# EAGLE board stm32_02 (EAGLE 9.5.2)
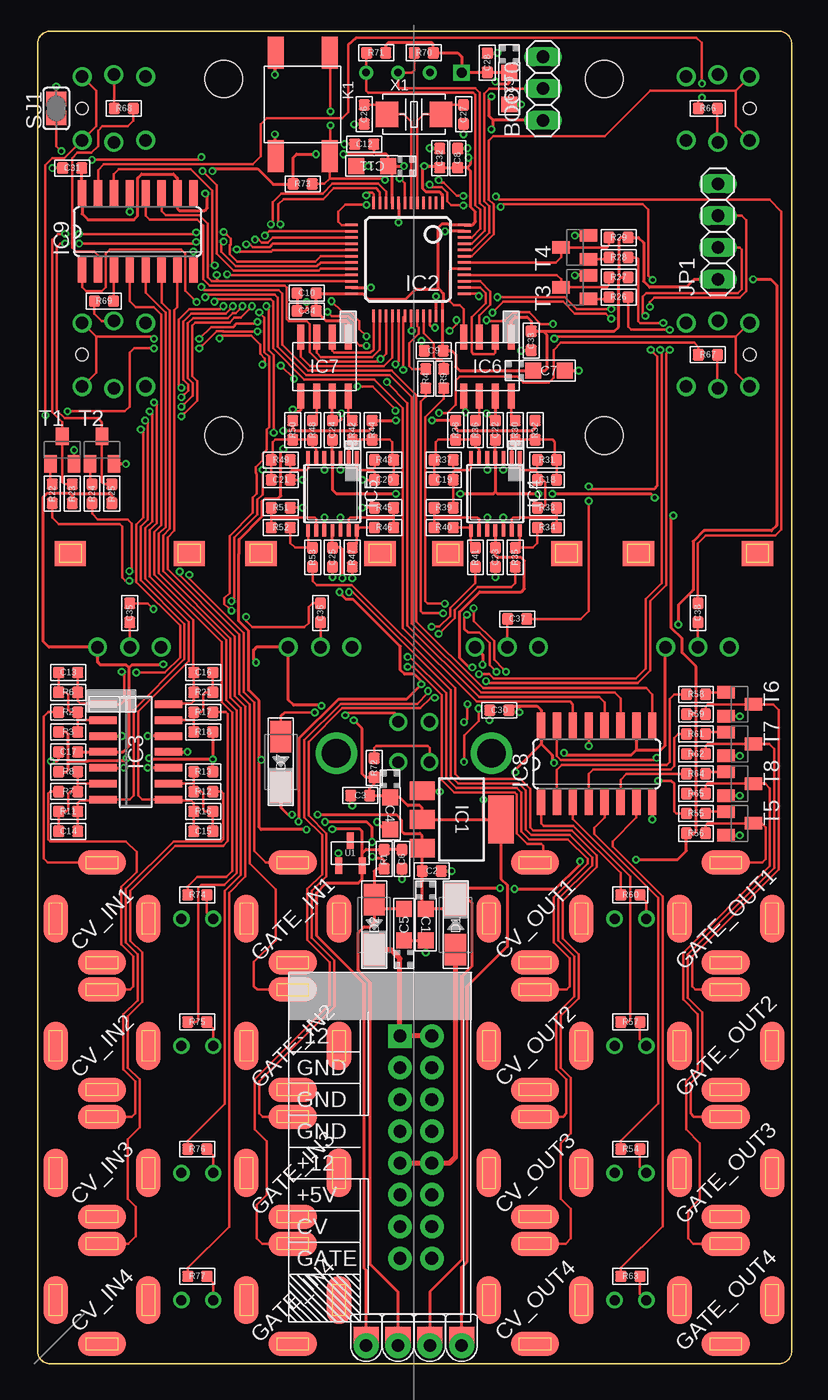
[diagram p4: board, top side]
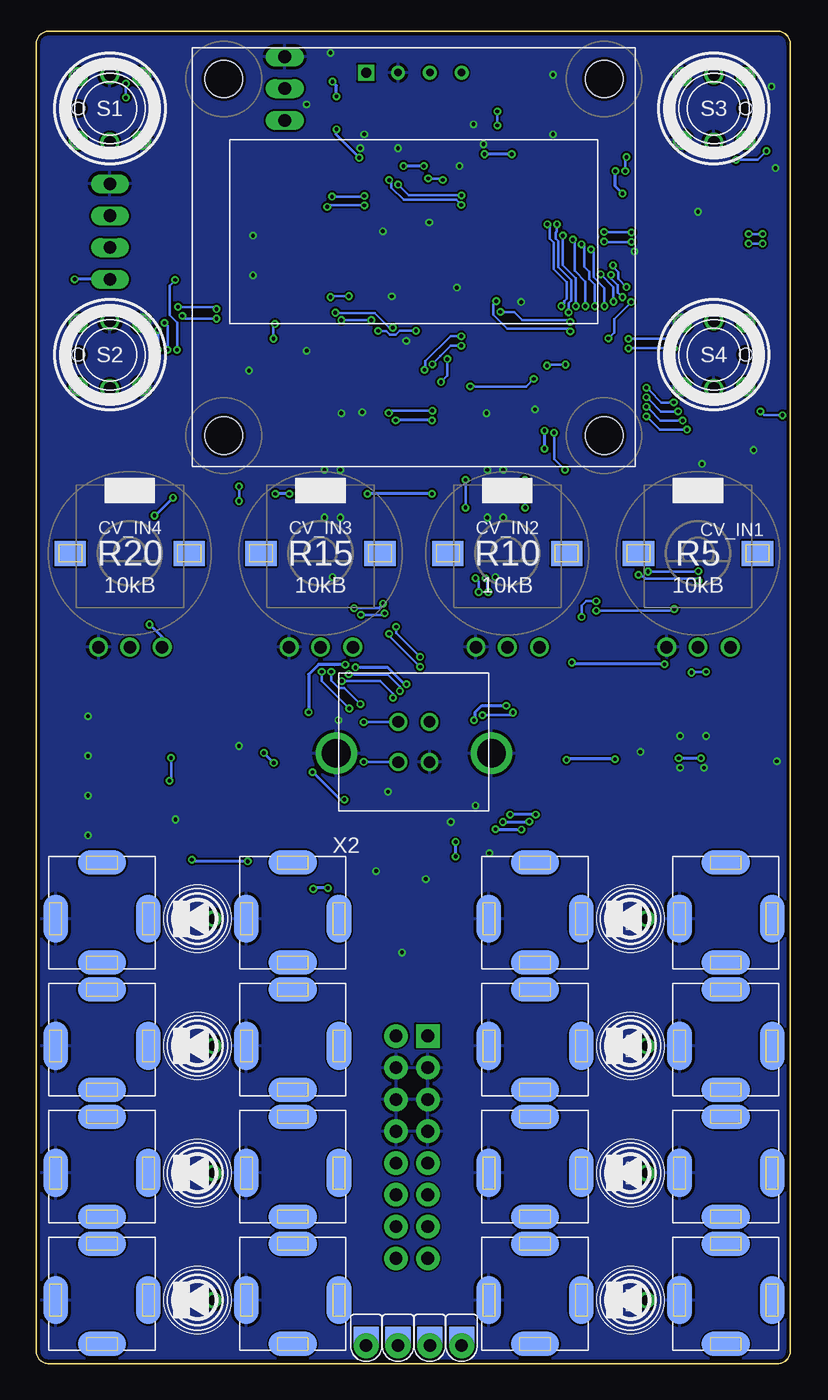
[diagram p5: board, bottom side, seen from below]

Size 60.25 x 106.5 mm. Coordinates in mm from the lower left corner, seen from the top.
Copper layers (1*16): Top 0.035mm / dielectric 1.5mm / Bottom 0.035mm
Design rules "ITeadstudio": minimum track width 6mil, minimum drill 12mil, track to track 6mil, track to pad 6mil, pad to pad 6mil, via to via 6mil, smd to smd 0mil, copper to edge 10mil, drill to drill 10mil, minimum pad ring 10mil, minimum via ring 6mil, stop-mask expansion 2mil, vias tented up to drill 100mil, thermal gap 10mil
Net classes: 0 default: width 0.203 mm; 1 POWER: width 0.254 mm

## Footprints (pad centres in the part's own frame; a part is rotated, then mirrored left to right if it is on the bottom)
1X03 = drill 1.016 long: 1 -2.54,0; 2 0,0; 3 2.54,0
CASE-A_3216 = smd 1.27 x 1.27: + -1.27,0; - 1.27,0
C0603 = smd 0.889 x 0.889: 1 -0.762,0; 2 0.762,0
DO-214AC = smd 2.5 x 1.7: 1 -2,0; 2 2,0
3MMLED = drill 0.8: + -1.27,0; - 1.27,0
SOT223 = smd 1.5 x 2: 1 -2.3,-3.15; 2 0,-3.15; 3 2.3,-3.15 | smd 3.8 x 2: 4 0,3.15
TQFP48 = smd 0.2 x 1: 1 -2.75,-4.5; 2 -2.25,-4.5; 3 -1.75,-4.5; 4 -1.25,-4.5; 5 -0.75,-4.5; 6 -0.25,-4.5; 7 0.25,-4.5; 8 0.75,-4.5; 9 1.25,-4.5; 10 1.75,-4.5; 11 2.25,-4.5; 12 2.75,-4.5; 25 2.75,4.5; 26 2.25,4.5; 27 1.75,4.5; 28 1.25,4.5; 29 0.75,4.5; 30 0.25,4.5; 31 -0.25,4.5; 32 -0.75,4.5; 33 -1.25,4.5; 34 -1.75,4.5; 35 -2.25,4.5; 36 -2.75,4.5 | smd 1 x 0.2: 13 4.5,-2.75; 14 4.5,-2.25; 15 4.5,-1.75; 16 4.5,-1.25; 17 4.5,-0.75; 18 4.5,-0.25; 19 4.5,0.25; 20 4.5,0.75; 21 4.5,1.25; 22 4.5,1.75; 23 4.5,2.25; 24 4.5,2.75; 37 -4.5,2.75; 38 -4.5,2.25; 39 -4.5,1.75; 40 -4.5,1.25; 41 -4.5,0.75; 42 -4.5,0.25; 43 -4.5,-0.25; 44 -4.5,-0.75; 45 -4.5,-1.25; 46 -4.5,-1.75; 47 -4.5,-2.25; 48 -4.5,-2.75
SO14 = smd 0.6 x 2.2: 1 -3.81,-2.6; 2 -2.54,-2.6; 3 -1.27,-2.6; 4 0,-2.6; 5 1.27,-2.6; 6 2.54,-2.6; 7 3.81,-2.6; 8 3.81,2.6; 9 2.54,2.6; 10 1.27,2.6; 11 0,2.6; 12 -1.27,2.6; 13 -2.54,2.6; 14 -3.81,2.6
TSSOP14 = smd 0.305 x 0.991: 1 -1.95,-2.918; 2 -1.3,-2.918; 3 -0.65,-2.918; 4 0,-2.918; 5 0.65,-2.918; 6 1.3,-2.918; 7 1.95,-2.918; 8 1.95,2.918; 9 1.3,2.918; 10 0.65,2.918; 11 0,2.918; 12 -0.65,2.918; 13 -1.3,2.918; 14 -1.95,2.918
SOIC8-N_MC = smd 1.981 x 0.559: 1 -2.362,1.905; 2 -2.362,0.635; 3 -2.362,-0.635; 4 -2.362,-1.905; 5 2.362,-1.905; 6 2.362,-0.635; 7 2.362,0.635; 8 2.362,1.905
SO16 = smd 0.66 x 2.032: 1 -4.445,-3.073; 2 -3.175,-3.073; 3 -1.905,-3.073; 4 -0.635,-3.073; 5 0.635,-3.073; 6 1.905,-3.073; 7 3.175,-3.073; 8 4.445,-3.073; 9 4.445,3.073; 10 3.175,3.073; 11 1.905,3.073; 12 0.635,3.073; 13 -0.635,3.073; 14 -1.905,3.073; 15 -3.175,3.073; 16 -4.445,3.073
POWER_16_SHROUDED = drill 1.016 pad 1.88 square: 1 -8.89,-1.27 | drill 1.016 pad 1.88: 2 -8.89,1.27; 3 -6.35,-1.27; 4 -6.35,1.27; 5 -3.81,-1.27; 6 -3.81,1.27; 7 -1.27,-1.27; 8 -1.27,1.27; 9 1.27,-1.27; 10 1.27,1.27; 11 3.81,-1.27; 12 3.81,1.27; 13 6.35,-1.27; 14 6.35,1.27; 15 8.89,-1.27; 16 8.89,1.27
3.5MM-JACK-SWITCH-13MM-NOHOLES = smd 1.95 x 3.85 bottom: RING_B@1 -3.7,0; SWITCH_B@1 3.7,0 | smd 1.95 x 3.85: RING_T@3 -3.7,0; SWITCH_T@3 3.7,0 | smd 3.85 x 1.95 bottom: SECOND_B@1 0,-3.5; TIP_B@1 0,4.5 | smd 3.85 x 1.95: SECOND_T@3 0,-3.5; TIP_T@3 0,4.5
1X04 = drill 1.016 long: 1 -3.81,0; 2 -1.27,0; 3 1.27,0; 4 3.81,0
4P-SMD-6.0X6.0X5.0H = smd 2.54 x 1.27: 1 -4.129,2.159; 2 -4.129,-2.159; 3 4.129,-2.159; 4 4.129,2.159
R0603 = smd 0.889 x 0.889: 1 -0.762,0; 2 0.762,0
ALPS_POT_SQUAREHOLES = drill 1: P$1 -2.5,-7.5; P$2 0,-7.5; P$3 2.58,-7.5 | smd 2.5 x 2: P$4 -4.75,0; P$5 4.75,0 | smd 2.5 x 2 bottom: P$6 -4.75,0; P$7 4.75,0
PB6149L = drill 1: 1 2.54,2.54; 2 2.54,-2.54; 3 -2.54,2.54; 4 -2.54,-2.54; LEDNEG 0,-2.7; LEDPOS 0,2.7 | hole 1: 2.54,0
SJ = smd 1.168 x 1.6: 1 -0.762,0; 2 0.762,0
SOT23-BEC = smd 1 x 1.4: B -0.95,-1.1; C 0,1.1; E 0.95,-1.1
SOT95P237X112-3N = smd 1.321 x 0.559: 1 -1.016,0.94; 2 -1.016,-0.94; 3 1.016,0
POWERTESTPAD = drill 1 pad 2: P$1 0,0 | smd 2 x 1.5: P$2 0,-0.75 | smd 2 x 1.5 bottom: P$3 0,-0.75
1.3_4PIN_OLED = drill 0.8 square: P$1 -3.81,0 | drill 0.6: P$2 -1.27,0; P$3 1.27,0; P$4 3.81,0 | hole 3: -15.2,-0.5; 15.2,-0.5; -15.2,-29; 15.2,-29
2P-SMD-5.0X3.2 = smd 1.778 x 2.032: 1 -2.159,0; 2 2.159,0
USB_B_VERT = drill 0.92: 1 1.25,1.6; 2 -1.25,1.6; 3 -1.25,-1.6; 4 1.25,-1.6 | drill 2.3: G1 -6.2,-0.9; G2 6.2,-0.9

## Placement (x,y rotation side)
BOOT0  [1X03]  40.39,101.92 90 top
C1  10uF  [CASE-A_3216]  31.02,35.08 270 top
C2  100nF  [C0603]  31.5,39.37 180 top
C3  100nF  [C0603]  25.79,45.4 0 top
C4  10uF  [CASE-A_3216]  28.17,43.97 270 top
C5  10uF  [CASE-A_3216]  29.28,35.08 90 top
C6  100nF  [C0603]  29.12,40.32 90 top
C7  10uF  [CASE-A_3216]  40.87,79.38 0 top
C8  100nF  [C0603]  33.56,96.36 270 top
C9  100nF  [C0603]  31.66,80.96 0 top
C10  100nF  [C0603]  21.5,85.57 0 top
C11  10uF  [CASE-A_3216]  26.74,95.73 180 top
C12  100nF  [C0603]  26.1,97.47 0 top
C13  3.3nF  [C0603]  2.45,55.24 0 top
C14  3.3nF  [C0603]  2.45,42.55 0 top
C15  3.3nF  [C0603]  13.24,42.55 180 top
C16  3.3nF  [C0603]  13.24,55.24 180 top
C17  [C0603]  2.45,48.9 0 top
C18  3.3nF  [C0603]  40.71,70.64 180 top
C19  3.3nF  [C0603]  32.45,70.64 0 top
C20  3.3nF  [C0603]  27.69,70.64 180 top
C21  3.3nF  [C0603]  19.43,70.64 0 top
C22  100nF  [C0603]  36.58,74.61 90 top
C23  100nF  [C0603]  36.58,64.45 90 top
C24  100nF  [C0603]  23.56,74.61 90 top
C25  100nF  [C0603]  23.56,64.45 90 top
C26  20pF  [C0603]  26.1,99.85 270 top
C27  20pF  [C0603]  34.04,99.85 270 top
C28  100nF  [C0603]  35.95,103.98 270 top
C29  10uF  [CASE-A_3216]  37.69,101.92 270 top
C30  100nF  [C0603]  36.9,52.23 0 top
C31  100nF  [C0603]  2.77,95.57 0 top
C32  100nF  [C0603]  32.13,96.36 270 top
C33  100nF  [C0603]  39.44,81.76 270 top
C34  100nF  [C0603]  21.5,84.14 180 top
C35  100nF  [C0603]  7.37,60.01 90 top
C36  100nF  [C0603]  22.61,60.01 90 top
C37  100nF  [C0603]  38.33,59.53 0 top
C38  100nF  [C0603]  52.77,60.01 90 top
D1  [DO-214AC]  33.41,35.08 90 top
D2  [DO-214AC]  26.9,35.08 270 top
D3  [3MMLED]  47.38,15.24 180 bottom
D4  [3MMLED]  47.38,25.4 180 bottom
D5  [3MMLED]  47.38,35.56 180 bottom
D6  [3MMLED]  47.38,5.08 180 bottom
D7  [DO-214AC]  19.43,48.1 270 top
D11  [3MMLED]  12.77,35.56 180 bottom
D12  [3MMLED]  12.77,25.4 180 bottom
D13  [3MMLED]  12.77,15.24 180 bottom
D14  [3MMLED]  12.77,5.08 180 bottom
IC1  LD1117AS33TR  [SOT223]  33.88,43.5 270 top
IC2  STM32F10XCXT6  [TQFP48]  29.59,88.27 180 top
IC3  MCP6004  [SO14]  7.85,48.9 270 top
IC4  TL074TSSOP14  [TSSOP14]  36.58,69.53 180 top
IC5  TL074TSSOP14  [TSSOP14]  23.56,69.53 180 top
IC6  MCP4822-E/SN  [SOIC8-N_MC]  35.95,79.69 270 top
IC7  MCP4822-E/SN  [SOIC8-N_MC]  22.93,79.69 270 top
IC8  74HC595D  [SO16]  44.68,47.94 0 top
IC9  74HC595D  [SO16]  8.01,90.49 0 top
J1  POWERSHROUDED  [POWER_16_SHROUDED]  30.23,17.3 270 top
J2  JACK  [3.5MM-JACK-SWITCH-13MM-NOHOLES]  5.15,35.56 0 bottom
J3  JACK  [3.5MM-JACK-SWITCH-13MM-NOHOLES]  5.15,25.4 0 bottom
J4  JACK  [3.5MM-JACK-SWITCH-13MM-NOHOLES]  5.15,15.24 0 bottom
J5  JACK  [3.5MM-JACK-SWITCH-13MM-NOHOLES]  5.15,5.08 0 bottom
J6  JACK  [3.5MM-JACK-SWITCH-13MM-NOHOLES]  20.39,35.56 0 bottom
J7  JACK  [3.5MM-JACK-SWITCH-13MM-NOHOLES]  20.39,25.4 0 bottom
J8  JACK  [3.5MM-JACK-SWITCH-13MM-NOHOLES]  20.39,15.24 0 bottom
J9  JACK  [3.5MM-JACK-SWITCH-13MM-NOHOLES]  20.39,5.08 0 bottom
J10  JACK  [3.5MM-JACK-SWITCH-13MM-NOHOLES]  39.76,35.56 0 bottom
J11  JACK  [3.5MM-JACK-SWITCH-13MM-NOHOLES]  39.76,25.4 0 bottom
J12  JACK  [3.5MM-JACK-SWITCH-13MM-NOHOLES]  39.76,15.24 0 bottom
J13  JACK  [3.5MM-JACK-SWITCH-13MM-NOHOLES]  39.76,5.08 0 bottom
J14  JACK  [3.5MM-JACK-SWITCH-13MM-NOHOLES]  54.99,35.56 0 bottom
J15  JACK  [3.5MM-JACK-SWITCH-13MM-NOHOLES]  54.99,25.4 0 bottom
J16  JACK  [3.5MM-JACK-SWITCH-13MM-NOHOLES]  54.99,15.24 0 bottom
J17  JACK  [3.5MM-JACK-SWITCH-13MM-NOHOLES]  54.99,5.08 0 bottom
JP1  [1X04]  54.36,90.49 90 top
K1  BUTTON-4P-3100010P1  [4P-SMD-6.0X6.0X5.0H]  21.18,100.65 270 top
PCB1  EURORACK_PCB12HP  [EURORACK12HPPCB]  -0.25,0 0 top
R1  10k  [R0603]  27.69,40.32 90 top
R2  100k  [R0603]  2.45,52.07 0 top
R3  100k  [R0603]  2.45,50.48 0 top
R4  20r  [R0603]  31.02,78.74 90 top
R5  10kB  [ALPS_POT_SQUAREHOLES]  7.37,64.77 0 bottom
R6  33k  [R0603]  2.45,53.66 0 top
R7  100k  [R0603]  2.45,45.72 0 top
R8  51k  [R0603]  2.45,47.31 0 top
R9  20r  [R0603]  32.45,78.74 90 top
R10  10kB  [ALPS_POT_SQUAREHOLES]  22.61,64.77 0 bottom
R11  33k  [R0603]  2.45,44.13 0 top
R12  100k  [R0603]  13.24,45.72 180 top
R13  51k  [R0603]  13.24,47.31 180 top
R15  10kB  [ALPS_POT_SQUAREHOLES]  37.53,64.77 0 bottom
R16  33k  [R0603]  13.24,44.13 180 top
R17  100k  [R0603]  13.24,52.07 180 top
R18  51k  [R0603]  13.24,50.48 180 top
R20  10kB  [ALPS_POT_SQUAREHOLES]  52.77,64.77 0 bottom
R21  33k  [R0603]  13.24,53.66 180 top
R22  100k  [R0603]  1.18,69.53 90 top
R23  10k  [R0603]  2.77,69.53 270 top
R24  100k  [R0603]  4.35,69.53 90 top
R25  10k  [R0603]  5.94,69.53 270 top
R26  100k  [R0603]  46.42,85.25 180 top
R27  10k  [R0603]  46.42,86.84 0 top
R28  100k  [R0603]  46.42,88.42 180 top
R29  10k  [R0603]  46.42,90.01 0 top
R30  12k  [R0603]  38.17,74.61 270 top
R31  30k  [R0603]  40.71,72.23 180 top
R32  1m  [R0603]  39.76,74.61 270 top
R33  100k  [R0603]  40.71,68.42 0 top
R34  100k  [R0603]  40.71,66.83 180 top
R35  100r  [R0603]  38.17,64.45 270 top
R36  12k  [R0603]  34.99,74.61 270 top
R37  30k  [R0603]  32.45,72.23 0 top
R38  1m  [R0603]  33.41,74.61 270 top
R39  100k  [R0603]  32.45,68.42 180 top
R40  100k  [R0603]  32.45,66.83 0 top
R41  100r  [R0603]  34.99,64.45 270 top
R42  12k  [R0603]  25.15,74.61 270 top
R43  30k  [R0603]  27.69,72.23 180 top
R44  1m  [R0603]  26.74,74.61 270 top
R45  100k  [R0603]  27.69,68.42 0 top
R46  100k  [R0603]  27.69,66.83 180 top
R47  100r  [R0603]  25.15,64.45 270 top
R48  12k  [R0603]  21.98,74.61 270 top
R49  30k  [R0603]  19.43,72.23 0 top
R50  1m  [R0603]  20.39,74.61 270 top
R51  100k  [R0603]  19.43,68.42 180 top
R52  100k  [R0603]  19.43,66.83 0 top
R53  100r  [R0603]  21.98,64.45 270 top
R54  56r  [R0603]  47.38,17.14 180 top
R55  100k  [R0603]  52.61,43.97 180 top
R56  10k  [R0603]  52.61,42.39 180 top
R57  56r  [R0603]  47.38,27.3 180 top
R58  100k  [R0603]  52.61,53.5 180 top
R59  10k  [R0603]  52.61,51.91 180 top
R60  56r  [R0603]  47.38,37.47 180 top
R61  100k  [R0603]  52.61,50.32 180 top
R62  10k  [R0603]  52.61,48.74 180 top
R63  56r  [R0603]  47.38,6.99 180 top
R64  100k  [R0603]  52.61,47.15 180 top
R65  10k  [R0603]  52.61,45.56 180 top
R66  56r  [R0603]  53.57,100.33 180 top
R67  56r  [R0603]  53.57,80.64 180 top
R68  56r  [R0603]  6.89,100.33 0 top
R69  56r  [R0603]  5.31,84.93 0 top
R70  2k  [R0603]  30.86,104.78 180 top
R71  2k  [R0603]  27.05,104.78 180 top
R72  1.5k  [R0603]  26.9,47.62 270 top
R73  10k  [R0603]  21.18,94.3 180 top
R74  56r  [R0603]  12.77,37.47 180 top
R75  56r  [R0603]  12.77,27.3 180 top
R76  56r  [R0603]  12.77,17.14 180 top
R77  56r  [R0603]  12.77,6.99 180 top
S1  SWITCH_W_LED_PB6149L-X-102BLUE  [PB6149L]  54.36,100.33 180 bottom
S2  SWITCH_W_LED_PB6149L-X-102BLUE  [PB6149L]  54.36,80.64 180 bottom
S3  SWITCH_W_LED_PB6149L-X-102BLUE  [PB6149L]  6.1,100.33 0 bottom
S4  SWITCH_W_LED_PB6149L-X-102BLUE  [PB6149L]  6.1,80.64 0 bottom
SJ1  [SJ]  1.5,100.33 90 top
T1  [SOT23-BEC]  1.97,73.03 0 top
T2  [SOT23-BEC]  5.15,73.03 0 top
T3  [SOT23-BEC]  42.93,86.04 90 top
T4  [SOT23-BEC]  42.93,89.22 90 top
T5  [SOT23-BEC]  56.11,43.18 270 top
T6  [SOT23-BEC]  56.11,52.7 270 top
T7  [SOT23-BEC]  56.11,49.53 270 top
T8  [SOT23-BEC]  56.11,46.35 270 top
U1  LM4040DIM3-5.0  [SOT95P237X112-3N]  24.99,40.8 90 top
U$7  VOLTAGETESTPAD  [POWERTESTPAD]  31.34,1.43 180 top
U$8  VOLTAGETESTPAD  [POWERTESTPAD]  28.8,1.43 180 top
U$37  VOLTAGETESTPAD  [POWERTESTPAD]  33.88,1.43 180 top
U$38  VOLTAGETESTPAD  [POWERTESTPAD]  26.26,1.43 180 top
U$44  4PIN_OLED  [1.3_4PIN_OLED]  30.07,103.19 0 bottom
X1  CRYSTAL-0500290P1  [2P-SMD-5.0X3.2]  30.07,99.85 0 top
X2  USB_B_FEMALE_VERT  [USB_B_VERT]  30.07,49.69 0 bottom

## Tracks (layer width: path | path; a pad name or v marks a point on that pad's centre or on a via)
3.3V  (via drill 0.3)
  Top 0.254: 32.34,95.39 C32.2 | C32.2 32.01,95.73 v30.9,95.73 30.75,95.57 30.75,93.94 31.02,93.66 32.13,93.66 32.34,93.45 IC2.1 | R71.1 27.82,105.38 28.01,105.57 31.5,105.57 31.63,105.44 R70.1 33.56,104.78 33.88,104.46 U$44.P$1 35.91,103.19 C28.2 35.98,103.19 C29.+ 37.69,102.39 37.6,102.3 36.76,102.3 v36.58,102.48 | C32.2 C8.2 34.33,95.6 | C17.2 IC3.4 6.83,48.9 7.31,49.37 7.31,55.63 | 7.31,55.63 7.05,55.88 4.99,55.88 4.79,56.08 R5.P$3 0.9,57.27 0.45,57.72 0.45,69.27 0.72,69.53 2.61,69.53 2.77,69.37 | U$37.P$1 33.88,7.7 34.29,8.12 34.29,30.1 37.53,33.34 37.53,38.26 37.03,38.76 IC1.4 35.79,43.5 | 35.79,43.5 IC1.2 30.73,44.42 30.55,44.61 29.59,44.61 28.96,45.24 C4.+ 28.01,45.4 C3.2 26.55,46.01 26.9,46.35 R72.2 26.23,46.86 25.94,47.15 25.94,50.75 v25.27,51.43 | v22.25,96.68 20.7,96.68 20.42,96.39 R73.2 20.39,94.27 18.83,94.27 17.59,95.5 14.15,95.5 v13.97,95.33 | IC7.1 24.83,83.19 24.67,83.34 23.05,83.34 C34.1 C10.2 22.31,85.52 IC2.24 26,85.52 26.42,85.09 29.44,85.09 30.24,85.89 32.09,85.89 | BOOT0.1 36.42,99.38 | 36.42,99.38 36.1,99.69 36.1,101.13 v36.26,101.29 | C31.2 3.53,93.59 IC9.16 3.56,91.92 4.04,91.44 7.69,91.44 8.01,91.76 8.01,94.77 8.32,95.09 10.86,95.09 11.18,94.77 IC9.10 11.18,92.33 11.34,92.18 13.35,92.18 13.56,92.39 13.56,93.36 v13.4,93.53 | 46.58,86.84 46.42,87 46.42,89.85 46.58,90.01 R29.2 48.01,90.01 48.43,89.59 48.43,86.52 48.91,86.04 51.82,86.04 52.45,86.68 JP1.1 | 46.58,86.84 R27.2 | 34.33,95.6 34.61,95.31 34.61,92.46 34.99,92.08 34.99,91.28 34.73,91.02 IC2.48 32.88,91.02 32.8,91.1 32.31,91.1 31.97,90.76 31.97,86.01 32.09,85.89
  Top 0.254: C30.2 37.98,52.55 38.48,52.55 | 38.48,52.55 39.91,52.55 40.23,52.23 IC8.16 40.23,49.53 | R23.2 2.77,69.37 | 2.77,69.37 2.92,69.53 5.78,69.53 5.94,69.37 R25.2 | v38.17,47.28 38.17,47.47 40.23,49.53 | v35.63,45.09 35.63,43.66 35.79,43.5 | 40.23,49.53 41.12,48.64 41.12,48.17 v41.27,48.02 | v42.06,48.82 42.24,48.64 47.44,48.64 47.85,49.05 | IC8.10 47.85,49.05 | IC6.1 37.85,83.34 38.17,83.66 39.12,83.66 39.44,83.34 C33.1 40.39,82.52 | 40.39,82.52 46.07,82.52 46.42,82.87 46.42,86.68 46.58,86.84 | v24.43,96.68 26.74,96.68 26.9,96.84 | 26.9,96.84 26.9,97.44 C12.2 | 26.9,96.84 27.05,96.68 27.85,96.68 28.01,96.52 C11.+ 28.17,95.73 | v22.69,52.59 22.44,52.59 22.39,52.64 20.46,52.64 20.03,53.06 R10.P$3 19.99,57.31 17.53,57.31 17.27,57.05 17.27,56.3 17.45,56.12 v17.45,56.04 | 7.31,55.63 7.56,55.88 10.02,55.88 v10.04,55.91 | 40.39,82.52 40.71,82.2 40.71,79.53 40.55,79.38 C7.+ 33.72,79.38 33.41,79.69 33.41,80.64 33.09,80.96 C9.2 32.34,81.04 IC2.36 32.34,84.98 32.43,85.06 32.43,85.55 32.09,85.89 | R15.P$3 35.56,56.66 v35.56,55.87 | v38.48,52.07 38.48,52.55 | 47.85,49.05 49.81,49.05 50.13,49.37 50.13,57.21 R20.P$3 | 34.33,95.6 34.61,95.89 34.61,96.22 v34.43,96.39 | v36.26,98.67 36.42,98.83 36.42,99.38 | v57.18,86.68 58.58,86.68 59.06,86.2 59.06,66.99 58.65,66.58 53.25,66.58 52.39,65.72 52.39,61.85 51.2,60.66 v51.2,59.08 | 28.17,95.73 v29.28,95.73 | IC2.9 28.34,95.55 28.17,95.73
  Bottom 0.254: v29.28,95.73 v30.9,95.73 | v22.25,96.68 v24.43,96.68 | v36.26,101.29 36.26,102.16 v36.58,102.48 | v38.17,47.28 35.98,45.09 v35.63,45.09 | v41.27,48.02 v42.06,48.81 v42.06,48.82 | v25.27,51.43 25.17,51.52 25.17,52.07 24.65,52.59 v22.69,52.59 | v10.04,55.91 17.31,55.91 v17.45,56.04 | v35.56,55.87 36.41,55.87 36.43,55.89 37.68,55.89 38.48,55.08 v38.48,52.07 | v13.4,93.53 13.97,94.1 v13.97,95.33 | v34.43,96.39 36.26,98.22 v36.26,98.67 | JP1.1 v57.18,86.68 | v51.2,59.08 50.19,58.07 R20.P$3
5V  (via drill 0.3)
  Top 0.203: D7.1 19.43,51.75 19.73,52.05 v22.15,52.05 | X2.1 28.82,51.72 28.56,51.99 24.75,51.99 v24.59,51.83
  Bottom 0.203: v22.15,52.05 22.38,51.83 v24.59,51.83
12V  (via drill 0.3)
  Top 0.254: C22.1 IC4.4 36.58,69.69 | C24.1 IC5.4 23.56,69.85 23.88,69.53 v28.63,69.53 | D1.2 32.67,36.35 C1.+ 30.74,36.64 C2.2 IC1.3 30.73,42.2 30.55,42.39 29.28,42.39 29.08,42.58 29.08,43.45 28.65,43.89 v22.38,43.89 | D1.2 34.42,37.08 34.67,36.83 34.67,31.75 33.89,30.96 33.89,8.28 31.34,5.74 U$7.P$1 | 52.45,51.91 52.61,51.75 52.61,48.74 | 52.45,51.91 R59.2 | 52.61,45.56 52.61,42.55 52.45,42.39 R56.2 51.85,40.99 51.15,40.28 v47.81,40.28 | 52.61,45.56 52.61,48.74 | R62.2 52.61,48.74 | R65.2 52.61,45.56 | D1.2 34.34,38.02 v36.95,38.02 | v38.12,37.94 41.38,37.94 43.34,39.9 v43.34,40.15 | 52.45,51.91 52.61,52.07 52.61,55.72 51.5,56.83 51.5,57.94 50.61,58.83 50.61,67.61 v50.79,67.79 | 36.58,69.69 36.74,69.53 v40.02,69.53 | v49.32,69.22 49,69.53 v41.14,69.53 | D7.2 19.43,44.45 20,43.89 v20.34,43.89 | v33.77,69.53 36.42,69.53 36.58,69.69
  Bottom 0.254: v36.95,38.02 38.04,38.02 v38.12,37.94 | v43.34,40.15 47.68,40.15 v47.81,40.28 | v40.02,69.53 v41.14,69.53 | v49.32,69.22 50.75,67.79 v50.79,67.79 | v20.34,43.89 20.59,43.89 20.61,43.91 22.35,43.91 v22.38,43.89 | v28.63,69.53 v33.77,69.53
-5V  (via drill 0.3)
  Top 0.254: R8.1 2.29,47.31 2.45,47.47 2.45,48.1 | 2.45,48.1 2.45,50.32 2.29,50.48 R3.1 | R13.1 v14.01,48.32 | v14.01,48.32 9.07,48.32 9,48.39 v8.91,48.39 | 2.45,48.1 2.52,48.17 4,48.17 4.04,48.21 6.95,48.21 v7.13,48.39 | C6.2 R1.2 27.66,41.12 26.26,41.12 25.93,40.79 | 25.93,40.79 U1.2 25.94,39.77 25.94,38.73 25.63,38.42 23.09,38.42 22.29,37.62 22.29,34.19 26.1,30.38 26.1,7.62 26.26,7.46 U$38.P$3 | R50.1 20.39,74.73 | 20.39,74.73 20.55,74.57 26.54,74.57 26.74,74.77 R44.1 28.6,75.37 v28.63,75.41 | R32.1 39.76,74.77 39.56,74.57 33.56,74.57 33.41,74.73 R38.1 33.37,75.41 v31.52,75.41 | R18.1 v14.01,48.32 | 25.93,40.79 25.93,42.56 25.73,42.76 23.58,42.76 v23.55,42.72 | v21.49,42.69 17.87,42.69 17.7,42.86 17.7,48.08 v17.88,48.26 17.7,48.44 17.7,52.99 16.86,53.83 16.86,58.57 16.08,59.35 16.08,64.75 16.1,64.77 16.1,65.88 17.95,67.73 17.95,68.92 18.18,69.14 19.21,69.14 19.43,69.37 19.43,72.93 v19.64,73.13 | v19.64,74.57 19.89,74.57 20.23,74.57 20.39,74.73
  Bottom 0.254: v7.13,48.39 v8.91,48.39 | v14.01,48.32 17.82,48.32 v17.88,48.26 | v23.55,42.72 21.51,42.72 v21.49,42.69 | v28.63,75.41 v31.52,75.41 | v19.64,73.13 v19.64,74.57
-12V  (via drill 0.3)
  Top 0.254: IC4.11 C23.2 36.58,64.61 36.78,64.41 38.66,64.41 38.89,64.19 38.89,61.94 38.64,61.69 35.32,61.69 33.72,60.09 33.72,56.41 34.48,55.65 v34.74,55.65 | IC5.11 C25.2 23.59,65.25 24.2,65.25 24.36,65.09 v24.36,62.79 | C5.- 27.63,36.35 26.94,37.04 | 26.94,37.04 D2.1 26.9,39.37 27.09,39.56 R1.1 27.69,40.2 27.53,40.36 26.91,40.36 v26.74,40.53 | U$8.P$3 28.8,5.71 26.58,7.94 26.58,30.48 25.63,31.43 25.63,34.45 26.1,34.92 26.58,34.92 26.94,35.29 26.94,37.04 | v26.74,41.7 26.74,42.86 26.3,43.3 v22.96,43.3 | v20.85,43.33 20.92,43.4 20.92,49.99 24.05,53.12 29.48,53.12 v30.66,54.3 30.66,54.55 30.09,55.11 29.33,55.11 28.99,55.46 28.99,57.33 25.23,61.09 24.65,61.09 24.31,61.43 24.31,61.49 v24.13,61.67
  Bottom 0.254: v26.74,40.53 v26.74,41.7 | v22.96,43.3 20.88,43.3 v20.85,43.33 | v24.13,61.67 24.2,61.74 24.2,62.63 v24.36,62.79 | v30.66,54.3 30.82,54.3 32.17,55.65 v34.74,55.65
BTN_IN1
  Top 0.203: S1.1 55.79,98.9 55.79,101.76 | 55.79,101.76 S1.2 | 55.79,101.76 48.96,101.76 45.31,98.11 36.42,98.11 36.06,97.75 36.06,93.06 36.44,92.67 36.44,90.27 34.69,88.52 IC2.43
BTN_IN2  (via drill 0.3)
  Top 0.203: S2.1 55.79,79.22 55.79,82.07 | 55.79,82.07 S2.2 | IC2.31 29.84,82.62 v29.9,82.56 | v41.29,81.93 41.43,82.07 55.79,82.07 | v41.18,83.1 40.22,83.1 39.28,84.04 38.01,84.04 37.31,83.34 35.94,83.34 v35.87,83.41 | v33.48,83.41 33.48,83.1 v32.93,82.55
  Bottom 0.203: v29.9,82.56 31.22,82.56 31.53,82.25 31.99,82.25 32.29,82.55 v32.93,82.55 | v41.29,81.93 41.29,83 v41.18,83.1 | v35.87,83.41 v33.48,83.41
BTN_IN3  (via drill 0.3)
  Top 0.203: S3.1 4.67,101.76 4.67,98.9 S3.2 2.13,96.36 1.18,96.36 0.6,95.78 0.6,75.83 v0.62,75.81 | IC2.30 29.22,83.64 v29.22,79.44 | v26.29,82.12 25.72,82.69 25.72,83.34 24.98,84.08 24.34,84.08 v23.49,84.93 | v9.31,81.15 7.72,81.15 7.37,80.8 7.37,76.52 6.98,76.12 v2.39,76.12 | v12.92,81.15 13.12,81.36 13.15,81.36 14.3,82.51 14.83,82.51 v17.57,82.51
  Bottom 0.203: v29.22,79.44 29.15,79.5 29.15,80.12 27.15,82.12 v26.29,82.12 | v0.62,75.81 2.07,75.81 v2.39,76.12 | v17.57,82.51 17.78,82.71 22.6,82.71 23.72,83.83 23.72,84.7 v23.49,84.93 | v9.31,81.15 v12.92,81.15
BTN_IN4  (via drill 0.3)
  Top 0.203: 4.67,82.07 S4.1 | 4.67,82.07 4.67,79.22 S4.2 | IC2.29 28.84,80.14 v28.59,79.89 | v26.29,81.36 25.76,81.36 25.37,81.76 25.37,83.19 24.83,83.72 23.5,83.72 v23.16,84.06 | 4.67,82.07 9.15,82.07 v9.31,81.92 | v12.92,81.92 13.87,82.87 15.62,82.87 15.87,83.11 17.42,83.11 v17.57,83.27
  Bottom 0.203: v28.59,79.89 27.96,80.52 27.96,80.53 27.13,81.36 v26.29,81.36 | v9.31,81.92 v12.92,81.92 | v17.57,83.27 17.73,83.43 21.42,83.43 22.05,84.06 v23.16,84.06
CS1
  Top 0.203: IC2.38 35.36,86.02 35.82,85.56 35.82,84.78 34.67,83.64 34.67,80.84 34.83,80.68 36.46,80.68 36.58,80.8 IC6.2
CS2
  Top 0.203: IC7.2 23.56,80.96 23.72,80.8 26.58,80.8 26.84,81.07 IC2.25
CV_IN1  (via drill 0.3)
  Top 0.203: C13.2 R6.2 3.21,52.96 3.4,52.77 5.18,52.77 IC3.1 6.61,52.7 6.93,53.02 6.93,55.09 v6.72,55.3 | v7.89,55.24 10.17,55.24 11.38,56.45 11.38,58.98 7.9,62.47 7.9,67.07 8.45,67.62 8.45,74.47 v8.24,74.67 | v11.49,75.72 11.7,75.93 11.72,75.93 12.76,76.97 12.76,78.54 12.36,78.94 12.36,82.98 12.61,83.23 15.34,83.23 15.73,83.62 16.25,83.62 16.93,84.3 16.93,84.33 v17.13,84.53 | IC2.14 18.51,90.52 v18.16,90.17
  Bottom 0.203: v6.72,55.3 7.84,55.3 v7.89,55.24 | v8.24,74.67 10.44,74.67 v11.49,75.72 | v17.13,84.53 17.13,86.76 18.16,87.79 v18.16,90.17
CV_IN2  (via drill 0.3)
  Top 0.203: C14.2 R11.2 3.21,44.83 3.4,45.02 5.18,45.02 IC3.7 7.37,45.09 7.69,45.4 7.69,52.26 11.74,56.31 11.74,59.13 8.25,62.62 8.25,66.92 8.8,67.47 8.8,75.19 v8.6,75.39 | v11.49,76.49 11.7,76.69 11.72,76.69 12.41,77.37 12.41,78.39 12,78.8 12,83.16 12.43,83.58 15.19,83.58 15.58,83.97 15.84,83.97 16.17,84.3 16.17,84.33 v16.37,84.53 | v17.37,89.85 17.69,89.85 17.93,89.61 18.4,89.61 18.8,90.02 IC2.15
  Bottom 0.203: v11.49,76.49 11.29,76.28 11.26,76.28 10.37,75.39 v8.6,75.39 | v16.37,84.53 16.37,86.5 17.23,87.36 17.23,89.72 v17.37,89.85
CV_IN3  (via drill 0.3)
  Top 0.203: C15.2 R16.2 12.48,44.83 12.29,45.02 10.51,45.02 IC3.8 8.36,45.09 8.04,45.4 8.04,52.11 12.09,56.16 12.09,59.28 8.61,62.76 8.61,66.78 9.16,67.33 9.16,75.91 v8.95,76.11 | v11.49,77.25 11.7,77.45 11.72,77.45 12.05,77.78 12.05,78.24 11.65,78.65 11.65,83.31 12.28,83.94 15.04,83.94 15.4,84.3 15.4,84.33 v15.61,84.53 | v16.68,89.47 16.96,89.47 17.18,89.26 18.54,89.26 18.8,89.52 IC2.16
  Bottom 0.203: v11.49,77.25 11.29,77.05 11.26,77.05 10.33,76.11 v8.95,76.11 | v15.61,84.53 15.61,86.24 16.06,86.69 16.06,87.29 16.47,87.7 16.47,89.27 v16.68,89.47
CV_IN4  (via drill 0.3)
  Top 0.203: IC3.14 10.51,52.77 12.29,52.77 12.48,52.96 R21.2 C16.2 12.45,55.28 12.45,59.42 8.96,62.91 8.96,66.63 9.51,67.18 9.51,76.63 v9.31,76.83 | v11.49,78.01 11.29,78.21 11.29,83.45 12.13,84.3 14.61,84.3 v14.85,84.53 | IC2.17 18.81,89.02 18.69,88.9 16.07,88.9 v15.91,89.06
  Bottom 0.203: v11.49,78.01 11.29,77.81 11.26,77.81 10.29,76.83 v9.31,76.83 | v14.85,84.53 14.85,85.98 15.71,86.84 15.71,88.85 v15.91,89.06
GATE_IN1  (via drill 0.3)
  Top 0.203: IC2.18 23.88,88.52 23.81,88.52 22.61,88.52 22.18,88.08 15.98,88.08 15.35,88.7 15.35,89.39 15.43,89.46 15.43,89.92 15.1,90.25 15.07,90.25 v14.87,90.46 | R23.1 2.16,70.29 1.97,70.48 T1.C 1.97,75.25 1.18,76.04 1.18,89.85 1.62,90.3 v2.21,90.3 | v3.33,90.3 12.56,90.3 v12.69,90.42
  Bottom 0.203: v2.21,90.3 v3.33,90.3 | v14.87,90.46 12.72,90.46 v12.69,90.42
GATE_IN2  (via drill 0.3)
  Top 0.203: R25.1 5.34,70.29 5.15,70.48 T2.C 5.15,75.25 4.83,75.56 2.16,75.56 1.53,76.19 1.53,89.26 1.81,89.53 v2.21,89.53 | v3.33,89.53 12.56,89.53 v12.69,89.66 | v14.87,89.69 14.67,89.49 14.67,88.89 15.83,87.73 22.33,87.73 22.62,88.02 IC2.19
  Bottom 0.203: v2.21,89.53 v3.33,89.53 | v14.87,89.69 14.84,89.66 v12.69,89.66
GATE_IN3
  Top 0.203: IC2.40 41.48,87.02 41.83,86.67 T3.C 45.47,86.04 45.66,86.23 R27.1
GATE_IN4
  Top 0.203: IC2.42 41.41,88.02 41.83,88.44 T4.C 45.47,89.22 45.66,89.41 R29.1
GATE_OUT1  (via drill 0.3)
  Top 0.203: IC8.15 41.5,48.58 41.82,48.26 49.32,48.26 v49.48,48.42 | v49.6,46.59 50.63,46.59 50.87,46.35 50.87,44.13 51.03,43.97 R55.2
  Bottom 0.203: v49.48,48.42 49.48,46.71 v49.6,46.59
GATE_OUT2
  Top 0.203: IC8.2 41.5,47.47 41.9,47.86 50.27,47.86 50.51,48.1 50.51,53.14 50.87,53.5 R58.2
GATE_OUT3
  Top 0.203: IC8.4 44.04,47.15 44.4,47.5 50.59,47.5 50.87,47.78 50.87,50.01 51.19,50.32 R61.2
GATE_OUT4
  Top 0.203: IC8.6 46.58,46.67 47.06,47.15 R64.2
GND  (via drill 0.3)
  Top 0.254: IC4.5 35.95,72.44 v35.95,71.44 | IC4.3 37.23,71.45 v37.22,71.44 | IC4.10 35.93,67.61 v35.95,67.63 | IC4.12 37.23,67.61 v37.22,67.63 | C25.1 v23.56,62.87 | IC5.12 24.21,67.61 v24.2,67.63 | IC5.10 22.93,66.63 v22.93,67.63 | IC5.5 22.91,71.45 v22.93,71.44 | IC5.3 24.21,71.45 v24.2,71.44 | IC3.10 v8.8,47.62 | IC3.12 v8.8,50.16 | IC3.5 v6.89,47.62 | IC2.8 v28.84,91.22 | IC2.35 v31.84,85.31 | IC2.23 v26.64,86.02 | IC2.47 v32.55,90.52 | K1.2 18.96,104.71 v18.96,103.03 | C12.1 v24.52,97.47 | C11.- v26.42,95.73 | C8.1 33.6,97.16 v34.36,97.16 | C32.1 31.37,97.12 v31.34,97.16 | C27.2 v34.04,98.27 | C26.2 26.07,99.06 v25.31,99.06 | C23.1 v36.58,62.87 | IC7.7 C24.2 24.17,75.37 24.27,75.48 v24.27,75.97 | IC6.7 C22.2 36.47,75.37 v35.87,75.97 | IC3.11 v11.97,48.9 | v1.06,48.16 1.55,48.16 1.69,48.29 C17.1 | IC3.3 v6.72,50.16 | IC8.8 v49.12,43.5 | IC8.13 v44.04,49.37 | K1.3 18.96,96.58 v18.96,98.27 | IC9.8 v12.45,88.9 | IC9.13 v7.37,92.08 | C31.1 v1.18,95.57 | T5.E v56.1,42.23 v56.11,42.23 | T8.E v56.1,45.41 v56.11,45.4 | T7.E v56.1,48.58 v56.11,48.58 | T6.E v56.1,51.76 v56.11,51.75 | C5.+ C1.- v31.02,32.86 | C9.1 30.68,81.18 v30.68,81.76 | T3.E v42.93,86.99 v42.93,87 | T4.E v42.93,90.17 | U1.1 24.04,39.8 v24.04,40.8 | C2.1 v33.09,39.37 | C6.1 v29.12,38.73 | 21.02,76.91 IC7.5 21.02,76.2 20.9,76.08 20.88,76.1 20.57,76.1 v20.39,76.28 | IC1.1 32.06,45.8 v32.13,45.72 | C3.1 25.02,44.74 v25.15,44.61 | 28.32,42.55 C4.- 27.72,42.7 v27.12,43.3 | C29.- v38.64,100.65 | C28.1 36.71,104.74 v36.74,104.78 | C10.1 C34.2 21.38,84.14 21.54,84.3 21.54,84.82 v21.5,84.86 | C7.- v43.25,79.38 | C33.2 39.41,80.96 v38.64,80.96 | T2.E 7.04,71.92 v7.05,71.91 | T1.E v2.92,73.02 v2.92,73.03
  Top 0.254: IC6.5 34.04,76.21 v34.2,76.05 | SJ1.2 v1.5,102.08 | C30.1 36.14,51.47 v36.1,51.44
  pour Bottom: -0.25,106.68 61.03,106.68 61.03,0 -0.25,0
LED_BTN1  (via drill 0.3)
  Top 0.203: IC9.15 4.83,95.41 5.31,95.89 17.21,95.89 17.85,96.52 17.85,99.06 18.32,99.54 24.36,99.54 24.83,100.01 24.83,105.41 25.47,105.97 52.61,105.97 53.09,105.57 v53.09,102.32 | v53.09,101.2 52.8,100.91 R66.2
  Bottom 0.203: v53.09,102.32 v53.09,101.2
LED_BTN2  (via drill 0.3)
  Top 0.203: IC9.1 3.56,86.04 3.88,85.72 5.15,85.72 5.46,86.04 5.46,88.74 5.78,89.06 11.5,89.06 11.81,88.74 11.81,85.75 v12.71,84.86 | R67.2 52.8,81.25 52.45,81.6 41.82,81.6 41.25,81.03 41.25,78.8 40.87,78.42 38.8,78.42 38.33,78.9 33.72,78.9 33.41,78.58 33.41,76.68 32.72,75.99 v32.08,75.99 | v14.53,81.95 14.73,82.15 17.06,82.15 17.78,81.44 17.78,80.71 18.16,80.33 18.16,80.05 v17.96,79.85 | v19.43,79.78 v20.49,78.72 | v25.57,78.11 26.79,78.11 28.59,76.31 v28.59,76.17
  Bottom 0.203: v12.71,84.86 14.08,83.49 14.08,82.41 v14.53,81.95 | v17.96,79.85 19.36,79.85 v19.43,79.78 | v20.49,78.72 21.1,78.11 v25.57,78.11 | v28.59,76.17 31.9,76.17 v32.08,75.99
LED_BTN3
  Top 0.203: R68.2 7.66,99.35 7.21,98.9 5.17,98.9 4.83,98.56 4.83,97.31 4.3,96.78 3.19,96.78 2.77,96.36 2.77,89.22 3.08,88.9 4.51,88.9 4.83,88.58 IC9.2
LED_BTN4
  Top 0.203: R69.2 6.07,87.38 IC9.3
LED_IN1
  Top 0.203: R74.2 12.01,38.13 12.77,38.89 15.07,38.89 15.54,39.37 15.54,52.06 14.7,52.9 14.7,57.67 9.32,63.06 9.32,66.48 9.87,67.03 9.87,83.86 9.28,84.45 7.85,84.45 7.37,84.93 IC9.4
LED_IN2
  Top 0.203: R75.2 12.67,27.3 12.83,27.46 12.83,38.01 13.09,38.26 14.94,38.26 15.9,39.22 15.9,52.21 15.06,53.05 15.06,57.82 9.68,63.2 9.68,66.33 10.22,66.88 10.22,84.01 8.64,85.59 IC9.5
LED_IN3
  Top 0.203: R76.2 12.01,17.81 14.95,20.76 14.95,37.77 16.25,39.07 16.25,52.39 15.41,53.23 15.41,57.97 10.03,63.35 10.03,66.19 10.58,66.74 10.58,84.16 9.91,84.83 IC9.6
LED_IN4
  Top 0.203: R77.2 12.01,7.65 15.31,10.95 15.31,37.62 16.61,38.92 16.61,52.54 15.77,53.38 15.77,58.12 10.39,63.5 10.39,66.04 10.94,66.59 10.94,84.21 11.18,84.45 IC9.7
LED_OUT1
  Top 0.203: R60.2 46.58,37.5 46.58,39.22 42.82,42.98 40.43,42.98 40.23,43.18 IC8.1
LED_OUT2
  Top 0.203: R57.2 47.22,27.3 47.38,27.46 47.38,38.92 42.77,43.53 IC8.3
LED_OUT3
  Top 0.203: R54.2 46.61,17.81 49.6,20.8 49.6,37.2 44.47,42.34 44.47,42.81 45.31,43.66 IC8.5
LED_OUT4
  Top 0.203: R63.2 46.61,7.65 49.95,10.99 49.95,37.35 45.95,41.36 45.95,41.75 47.85,43.66 IC8.7
MOSI1
  Top 0.203: IC2.41 33.13,87.52 32.93,87.31 32.93,84.93 33.25,84.61 33.72,84.61 34.04,84.3 IC6.4
MOSI2
  Top 0.203: IC7.4 21.02,80.49 21.77,79.74 27.66,79.74 28.34,80.43 IC2.28
N$1
  Top 0.381: J1.2 J1.1 28.96,32.38 28.25,33.08 D2.2
N$2
  Top 0.381: J1.9 J1.10 32.93,16.03 33.41,16.51 D1.1
N$3
  Top 0.203: R5.P$2 C35.1
N$4
  Top 0.203: J2.TIP_T@3 0.81,40.06 0.51,40.36 0.51,51.71 0.86,52.07 R2.1
N$5
  Top 0.203: C13.1 R6.1 2.29,53.66 2.45,53.5 2.45,52.23 2.61,52.07 R2.2 3.21,51.44 | R3.2 3.21,51.44 | IC3.2 3.21,51.44
N$6  (via drill 0.3)
  Top 0.203: J7.TIP_T@3 17.55,29.9 17.29,30.16 17.29,32.09 19.04,33.84 19.04,37.92 16.96,39.99 16.96,52.69 16.13,53.53 16.13,58.26 11.36,63.02 v11.36,63.31 | R24.1 4.35,67.94 4.83,67.47 7.21,67.47 7.54,67.14 7.54,63.54 v7.34,63.34
  Bottom 0.203: v11.36,63.31 7.37,63.31 v7.34,63.34
N$7
  Top 0.203: R10.P$2 C36.1
N$8
  Top 0.203: R7.1 1.02,45.72 0.86,45.56 0.86,41.91 1.02,41.75 7.05,41.75 7.91,40.89 7.91,39.3 6.7,38.09 6.7,33.51 7.65,32.55 7.65,30.16 7.39,29.9 J3.TIP_T@3
N$9
  Top 0.203: C14.1 R11.1 2.29,44.13 2.45,44.29 2.45,45.56 2.61,45.72 R7.2 3.21,46.35 | R8.2 3.21,46.35 | IC3.6 3.21,46.35
N$10
  Top 0.203: T2.B 4.2,70.45 R24.2
N$11
  Top 0.203: R15.P$2 37.53,59.5 C37.1
N$12
  Top 0.203: R12.1 14.67,45.72 14.83,45.56 14.83,41.91 14.67,41.75 10.86,41.75 7.05,37.94 7.05,33.66 8.01,32.7 8.01,29.05 6.86,27.9 6.86,23.51 7.81,22.55 7.81,20 7.55,19.74 J4.TIP_T@3
N$13
  Top 0.203: C15.1 R16.1 13.4,44.13 13.24,44.29 13.24,45.56 13.09,45.72 R12.2 12.48,46.35 | R13.2 12.48,46.35 | IC3.9 12.48,46.35
N$14  (via drill 0.3)
  Top 0.203: J8.TIP_T@3 17.99,19.74 17.73,20 17.73,22.55 23.72,28.55 23.72,32.22 21.91,34.03 21.91,37.78 23.09,38.96 23.09,42.39 21.66,43.81 21.66,49.69 24.36,52.39 30.58,52.39 31.42,53.22 v31.73,53.22 | v35.83,54.55 35.99,54.39 47.95,54.39 48.96,55.4 48.96,60.96 50.23,62.23 50.23,80.72 50.31,80.81 50.31,80.83 v50.52,81.04 | R26.1 47.18,82.9 47.45,82.63 v50.52,82.63
  Bottom 0.203: v31.73,53.22 31.73,53.54 32.75,54.55 v35.83,54.55 | v50.52,81.04 v50.52,82.63
N$15
  Top 0.203: R20.P$2 C38.1
N$16
  Top 0.203: J5.TIP_T@3 7.27,9.58 7.85,10.16 7.85,12.54 7.21,13.18 7.21,17.94 8.16,18.89 8.16,22.7 7.21,23.65 7.21,27.75 8.36,28.9 8.36,32.85 7.41,33.8 7.41,37.79 11.01,41.4 14.82,41.4 15.19,41.76 15.19,51.91 15.03,52.07 R17.1
N$17
  Top 0.203: C16.1 R21.1 13.4,53.66 13.24,53.5 13.24,52.23 13.09,52.07 R17.2 12.48,51.44 | 12.48,51.44 R18.2 | IC3.13 12.48,51.44
N$18
  Top 0.203: T3.B 45.5,85.09 R26.2
N$19  (via drill 0.3)
  Top 0.203: J6.TIP_T@3 18.22,40.06 17.32,40.96 17.32,52.84 16.48,53.67 16.48,58.41 12.13,62.77 v12.13,63.05 | R22.1 1.18,67.63 1.69,67.11 6.58,67.11 6.78,66.91 6.78,62.82 7.02,62.58 v7.34,62.58
  Bottom 0.203: v12.13,63.05 11.89,63.05 11.6,62.75 7.51,62.75 v7.34,62.58
N$20
  Top 0.203: T1.B 1.02,70.45 R22.2
N$21  (via drill 0.3)
  Top 0.203: J9.TIP_T@3 17.95,9.58 17.53,10 17.53,12.7 18.32,13.49 18.32,17.78 17.37,18.73 17.37,22.7 23.37,28.7 23.37,32.08 21.56,33.89 21.56,37.93 22.73,39.1 22.73,42.24 21.3,43.67 21.3,49.84 24.21,52.74 30.34,52.74 31.2,53.6 v31.2,53.76 | v35.27,55.11 36.08,55.11 36.44,54.75 47.79,54.75 48.61,55.56 48.61,61.11 49.88,62.38 49.88,80.92 v49.76,81.04 | R28.1 47.85,88.42 48.01,88.27 48.01,83.34 48.17,83.19 v49.99,83.19 v50,83.19
  Bottom 0.203: v35.27,55.11 35.23,55.07 32.16,55.07 31.2,54.11 v31.2,53.76 | v50,83.19 49.76,82.95 v49.76,81.04
N$22
  Top 0.203: T4.B 45.5,88.27 R28.2
N$23
  Top 0.203: IC4.2 37.88,73.06 38.17,73.34 R30.2 R32.2 41.15,73.85 41.34,73.66 41.34,72.36 R31.1 C18.1
N$24
  Top 0.203: IC4.1 38.53,71.55 38.64,71.44 39.76,71.44 | R31.2 39.95,71.63 39.76,71.44 | 39.76,71.44 39.95,71.25 C18.2 40.42,70.64 40.58,70.48 40.58,68.58 40.42,68.42 R33.1
N$25  (via drill 0.3)
  Top 0.203: J10.TIP_T@3 40.39,40.7 40.39,41.4 40.23,41.55 39.12,41.55 38.28,42.39 38.28,45.5 38.14,45.65 33.31,45.65 32.29,46.67 32.29,53.45 30.05,55.7 v29.57,55.7 | v32.05,58.34 33.32,59.61 33.32,60.23 35.16,62.07 37.85,62.07 38.17,62.39 R35.2
  Bottom 0.203: v29.57,55.7 32.05,58.18 v32.05,58.34
N$26
  Top 0.203: R33.2 41.47,67.63 | 41.47,67.63 R34.1 | IC4.13 37.88,67.5 38.01,67.63 41.47,67.63
N$27
  Top 0.203: IC4.14 38.53,65.26 38.48,65.22 R35.1 39.56,65.22 39.95,65.6 R34.2
N$28
  Top 0.203: IC6.8 37.85,75.69 R30.1
N$29
  Top 0.203: IC4.6 35.28,73.06 34.99,73.34 34.99,73.82 | 34.99,73.82 R36.2 | 34.99,73.82 34.96,73.85 R38.2 32.01,73.85 31.82,73.66 31.82,72.36 R37.1 C19.1
N$30
  Top 0.203: IC4.7 34.63,71.55 34.52,71.44 33.41,71.44 | R37.2 33.22,71.63 33.41,71.44 | 33.41,71.44 33.22,71.25 C19.2 R39.1
N$31
  Top 0.203: R40.1 31.69,67.63 | 31.69,67.63 R39.2 | IC4.9 35.28,67.5 35.15,67.63 31.69,67.63
N$32
  Top 0.203: R40.2 34.41,66.83 IC4.8 34.63,65.58 R41.1
N$33
  Top 0.203: IC6.6 35.31,75.69 R36.1
N$34  (via drill 0.3)
  Top 0.203: J11.TIP_T@3 42.27,29.9 42.54,30.16 42.54,32.41 41.27,33.68 41.27,37.28 43.97,39.98 43.97,40.32 42.38,41.91 39.28,41.91 38.64,42.55 38.64,45.65 38.28,46.01 33.47,46.01 32.65,46.83 32.65,53.6 29.76,56.49 v29.57,56.49 | R41.2 34.99,62.4 32.97,60.38 32.97,59.75 32.11,58.9 v31.49,58.9
  Bottom 0.203: v29.57,56.49 31.49,58.41 v31.49,58.9
N$35
  Top 0.203: IC5.2 24.86,73.06 25.15,73.34 R42.2 R44.2 28.13,73.85 28.32,73.66 28.32,72.36 R43.1 C20.1
N$36  (via drill 0.3)
  Top 0.203: IC5.1 25.51,71.55 25.63,71.44 26.74,71.44 | 26.74,71.44 26.93,71.25 C20.2 v25.94,70.64 | 26.74,71.44 26.93,71.63 R43.2 | R45.1 v25.94,68.42
  Bottom 0.203: v25.94,68.42 v25.94,70.64
N$37
  Top 0.203: IC5.13 24.86,67.5 24.99,67.63 28.45,67.63 | R46.1 28.45,67.63 | 28.45,67.63 R45.2
N$38
  Top 0.203: R47.1 25.51,65.58 IC5.14 25.73,66.83 R46.2
N$39
  Top 0.203: R42.1 24.83,75.69 IC7.8
N$40  (via drill 0.3)
  Top 0.203: J12.TIP_T@3 41.99,19.74 42.26,20 42.26,22.71 41.46,23.51 41.46,27.93 42.89,29.36 42.89,32.55 41.62,33.83 41.62,37.14 44.32,39.84 44.32,40.47 42.52,42.27 39.44,42.27 39,42.7 39,45.8 38.43,46.36 33.63,46.36 33.01,46.99 33.01,53.85 25.18,61.67 v24.89,61.67 | v25.15,62.79 R47.2
  Bottom 0.203: v24.89,61.67 24.89,62.53 v25.15,62.79
N$41
  Top 0.203: IC5.6 22.26,73.06 21.98,73.34 R48.2 R50.2 18.99,73.85 18.8,73.66 18.8,72.1 | 18.8,72.1 R49.1 | C21.1 18.67,71.98 18.8,72.1
N$42  (via drill 0.3)
  Top 0.203: IC5.7 21.61,71.55 21.5,71.44 20.39,71.44 | 20.39,71.44 20.2,71.25 C21.2 v21.18,70.64 | 20.39,71.44 20.2,71.63 R49.2 | R51.1 v21.18,68.42
  Bottom 0.203: v21.18,68.42 v21.18,70.64
N$43
  Top 0.203: R52.1 18.67,67.63 | 18.67,67.63 R51.2 | IC5.9 22.26,67.5 22.13,67.63 18.67,67.63
N$44
  Top 0.203: IC5.8 21.61,65.58 R53.1 20.58,65.22 20.2,65.6 R52.2
N$45
  Top 0.203: R48.1 22.29,75.69 IC7.6
N$46
  Top 0.203: J13.TIP_T@3 42.19,9.58 42.61,10 42.61,12.38 41.82,13.18 41.82,17.62 42.61,18.41 42.61,22.86 41.82,23.65 41.82,27.78 43.25,29.21 43.25,32.7 41.98,33.97 41.98,36.99 44.68,39.69 44.68,40.62 42.67,42.62 39.59,42.62 39.35,42.86 39.35,45.95 38.58,46.72 33.79,46.72 33.36,47.15 33.36,53.99 25.12,62.23 22.29,62.23 21.98,62.55 R53.2
N$47
  Top 0.203: R69.1 4.54,83.95 5.15,83.34 S4.LEDPOS
N$48
  Top 0.203: R68.1 6.13,103 S3.LEDPOS
N$49
  Top 0.203: T5.B 53.53,44.13 R55.1
N$50
  Top 0.203: J14.TIP_T@3 57.91,40.06 58.17,40.32 58.17,42.86 57.85,43.18 T5.C 53.57,43.18 53.38,42.99 R56.1
N$51
  Top 0.203: R54.1 48.14,15.75 D3.-
N$52
  Top 0.203: R67.1 54.33,77.98 S2.LEDPOS
N$53
  Top 0.203: T6.B 53.53,53.66 R58.1
N$54
  Top 0.203: J15.TIP_T@3 52.56,29.9 52.3,30.16 52.3,32.54 59.24,39.48 59.24,52.26 58.79,52.7 T6.C 53.57,52.7 53.38,52.51 R59.1
N$55
  Top 0.203: S1.LEDPOS 54.33,97.66 R66.1
N$56
  Top 0.203: IC2.32 30.34,82.91 30.46,82.79 30.46,82.33 29.7,81.57 29.7,79.75 29.94,79.5 R4.2
N$57
  Top 0.203: T7.B 53.53,50.48 R61.1
N$58
  Top 0.203: J16.TIP_T@3 52.44,19.74 52.18,20 52.18,22.39 53.13,23.35 53.13,28.06 51.94,29.25 51.94,32.69 58.88,39.63 58.88,49.12 58.48,49.53 T7.C 53.57,49.53 53.38,49.34 R62.1
N$59
  Top 0.203: R63.1 48.14,5.59 D6.-
N$60
  Top 0.203: IC2.33 30.84,82.38 31.66,81.57 31.66,80.49 31.88,80.26 32.29,80.26 32.45,80.11 R9.2
N$61
  Top 0.203: T8.B 53.53,47.3 R64.1
N$62
  Top 0.203: J17.TIP_T@3 52.4,9.58 51.98,10 51.98,12.22 52.93,13.18 52.93,17.62 51.82,18.73 51.82,22.54 52.77,23.5 52.77,27.91 51.59,29.1 51.59,32.84 58.53,39.78 58.53,45.99 58.16,46.35 T8.C 53.57,46.35 53.38,46.16 R65.1
N$63
  Top 0.203: IC2.5 30.34,99.33 30.86,99.85 X1.2 32.99,100.62 C27.1
N$64
  Top 0.203: IC2.6 29.84,99.29 29.28,99.85 X1.1 27.15,100.62 C26.1
N$65
  Top 0.203: R57.1 48.14,25.91 D4.-
N$67
  Top 0.203: R60.1 48.65,36.96 D5.-
N$77  (via drill 0.3)
  Top 0.203: IC2.20 22.62,87.52 22.47,87.37 15.68,87.37 14.31,88.74 14.31,94.2 v13.18,95.33 | v13.09,96.44 12.88,96.24 4.36,96.24 v4.34,96.22 | v1.9,96.92 1.5,97.32 SJ1.1
  Bottom 0.203: v13.18,95.33 13.18,96.35 v13.09,96.44 | v4.34,96.22 2.6,96.22 v1.9,96.92
N$78
  Top 0.203: BOOT0.2 36.1,101.92 35.7,101.52 35.7,92.91 36.09,92.53 36.09,90.42 34.69,89.02 IC2.44
N$80  (via drill 0.3)
  Top 0.203: IC8.9 49.12,53.5 48.63,53.99 35.6,53.99 30.25,59.3 30.25,77.4 28.31,79.38 21.62,79.38 19.56,81.45 19.56,85.52 19.28,85.8 13.34,85.8 v13.09,86.06 | IC9.14 6.1,95.09 6.48,95.47 12.24,95.47 13.96,93.76 13.96,88 v14.16,87.79
  Bottom 0.203: v13.09,86.06 13.76,86.73 13.76,87.26 14.16,87.66 v14.16,87.79
N$81
  Top 0.203: R74.1 13.53,36.07 D11.-
N$82
  Top 0.203: R75.1 14.04,26.8 D12.-
N$83
  Top 0.203: R76.1 14.04,16.64 D13.-
N$84
  Top 0.203: R77.1 14.04,6.48 D14.-
POT1  (via drill 0.3)
  Top 0.203: IC2.10 27.84,93.67 27.21,94.3 23.54,94.3 22.78,93.54 19.49,93.54 18.8,92.85 18.8,91.23 v18.64,91.07 | C35.2 8.81,60.77 v9.26,60.31 | v15.5,60.19 15.29,60.39 15.26,60.39 14.94,60.72 14.94,61.18 15.34,61.59 15.34,66.17 17.21,68.03 17.21,69.22 17.53,69.54 17.53,71.12 17.44,71.21 17.44,71.67 17.97,72.21 17.97,72.72 18.32,73.06 18.32,74.64 18.52,74.84 18.52,80.47 18.13,80.86 18.13,83.61 v17.71,84.03
  Bottom 0.203: v17.71,84.03 17.69,84.05 17.69,84.77 17.49,84.97 17.49,86.61 18.52,87.64 18.52,89.73 18.72,89.94 18.72,90.4 18.64,90.48 v18.64,91.07 | v9.26,60.31 9.39,60.19 v15.5,60.19
POT2  (via drill 0.3)
  Top 0.203: IC2.11 27.34,93.65 27.05,93.94 23.68,93.94 22.83,93.09 19.68,93.09 19.24,92.66 19.24,91.23 v19.4,91.07 | v16.66,59.69 16.66,59.37 17.17,58.86 21.31,58.86 21.66,59.21 21.66,60.48 21.98,60.8 22.58,60.8 C36.2 | v15.5,60.95 15.7,61.15 15.7,66.02 17.57,67.89 17.57,69.07 17.97,69.48 17.97,71.42 v18,71.44 | v18.87,74.41 18.87,80.62 18.49,81.01 18.49,84.33 v18.29,84.53
  Bottom 0.203: v16.66,59.69 v16.65,59.68 16.65,60.59 16.29,60.95 v15.5,60.95 | v18,71.44 18.87,72.32 v18.87,74.41 | v18.29,84.53 18.05,84.77 18.05,84.91 17.84,85.12 17.84,86.46 18.88,87.5 18.88,89.59 19.2,89.91 19.2,90.87 v19.4,91.07
POT3  (via drill 0.3)
  Top 0.203: C37.2 43.41,59.53 44.04,60.17 v44.04,68.95 | v44.04,70.12 44.24,69.91 49.27,69.91 49.52,70.17 49.52,80.48 49.2,80.81 49.2,80.83 v48.99,81.04 | IC2.12 26.84,93.48 26.74,93.59 26.46,93.59 v26.26,93.38 | v49.15,86.63 48.81,86.96 48.81,92.23 48.37,92.67 37.2,92.67 v37,92.47 | v31.33,94.25 31.53,94.04 32.29,94.04 32.73,93.61 32.73,92.91 33.06,92.58 v34.03,92.58
  Bottom 0.203: v44.04,68.95 v44.04,70.12 | v48.99,81.04 48.99,83.22 49.6,83.82 49.6,86.18 v49.15,86.63 | v37,92.47 36.88,92.58 v34.03,92.58 | v26.26,93.38 30.47,93.38 v31.33,94.25
POT4  (via drill 0.3)
  Top 0.203: C38.2 52.77,65.56 53.41,66.2 58.96,66.2 59.44,66.67 59.44,92.08 58.49,93.03 36.88,93.03 v36.62,93.29 | IC2.13 24.3,91.02 24.04,91.28 24.04,92.08 24.59,92.62 v26.29,92.62 | v32.05,94.6 32.25,94.4 32.44,94.4 33.49,93.34 v34.03,93.34
  Bottom 0.203: v36.62,93.29 34.09,93.29 v34.03,93.34 | v26.29,92.62 26.49,92.82 26.7,93.03 30.9,93.03 31.89,94.02 31.89,94.44 v32.05,94.6
RCK595  (via drill 0.3)
  Top 0.203: IC9.12 8.64,91.76 8.96,91.44 12.77,91.44 13.24,90.96 13.24,86.69 13.77,86.16 19.75,86.16 19.91,86 19.91,83.5 20.07,83.34 21.5,83.34 21.76,83.08 21.76,80.83 22.5,80.09 27.19,80.09 v27.4,80.3 27.84,80.75 IC2.27 | IC8.12 45.31,52.86 44.89,53.28 35.28,53.28 29.54,58.98 29.54,76.79 v27.91,78.47
  Bottom 0.203: v27.91,78.47 27.4,78.98 v27.4,80.3
RESET  (via drill 0.3)
  Top 0.203: IC2.7 29.34,94.36 28.97,94.73 v28.93,94.73 | K1.4 23.34,96.36 | 23.34,96.36 23.34,94.72 | R73.1 22.92,94.3 23.34,94.72 | v27.76,94.61 27.66,94.72 23.34,94.72 | K1.1 23.4,104.71 v23.4,100.09 | v23.4,98.98 23.4,96.42 23.34,96.36
  Bottom 0.203: v28.93,94.73 27.88,94.73 v27.76,94.61 | v23.4,100.09 v23.4,98.98
SCK1
  Top 0.203: IC6.3 35.31,83.77 36.18,84.64 36.18,85.7 35.37,86.52 IC2.39
SCK2
  Top 0.203: IC7.3 22.29,80.8 22.65,80.45 26.73,80.45 27.34,81.07 IC2.26
SCK595  (via drill 0.3)
  Top 0.203: IC9.11 9.91,92.11 10.23,91.8 12.91,91.8 13.6,91.11 13.6,86.84 13.92,86.52 14.51,86.52 | IC2.22 14.51,86.52 | IC8.11 46.58,53.18 46.12,53.64 35.44,53.64 29.9,59.14 29.9,77.25 28.16,79.03 21.48,79.03 19.2,81.3 19.2,85.21 18.96,85.45 13.61,85.45 v13.4,85.25 | v14.31,87.03 14.31,86.71 14.51,86.52
  Bottom 0.203: v13.4,85.25 13.77,85.61 13.77,86.2 14.31,86.74 v14.31,87.03
SCL
  Top 0.203: IC2.45 34.68,89.52 35.73,90.56 35.73,92.38 35.35,92.76 35.35,101.59 34.98,101.96 28.92,101.96 28.8,102.08 U$44.P$3 29.91,103.19 30.1,103.38 R70.2
SDA
  Top 0.203: IC2.46 34.67,90.01 35.37,90.71 35.37,92.23 34.99,92.61 34.99,101.44 34.83,101.6 26.42,101.6 26.26,101.76 U$44.P$4 26.26,104.74 R71.2
SER595  (via drill 0.3)
  Top 0.203: IC8.14 42.77,52.7 42.55,52.93 35.09,52.93 29.19,58.79 29.19,76.36 26.91,78.67 21.33,78.67 18.84,81.16 18.84,84.89 18.64,85.09 14.33,85.09 v14.12,84.89 | v15.15,87.07 15.21,87.02 IC2.21
  Bottom 0.203: v14.12,84.89 14.12,86.05 v15.15,87.07
SWCLK  (via drill 0.3)
  Top 0.203: IC2.37 35.07,85.52 v35.27,85.32 | v36.74,85.25 42.14,85.25 43.09,84.3 v45.84,84.3 | JP1.3 56.27,91.76 56.62,91.4 56.62,85.74 56.09,85.21 49.28,85.21 48.92,84.86 v48.92,84.47
  Bottom 0.203: v35.27,85.32 36.66,85.32 v36.74,85.25 | v45.84,84.3 46.01,84.47 v48.92,84.47
SWDIO  (via drill 0.3)
  Top 0.203: IC2.34 31.34,83.02 31.56,82.81 v31.76,82.81 | v36.35,84.01 37.23,84.89 41.99,84.89 42.94,83.94 45.4,83.94 45.81,83.53 v45.84,83.53 | JP1.2 56.11,89.22 56.27,89.06 56.27,85.88 55.95,85.57 48.65,85.57 48.37,85.29 48.37,83.95 v48.57,83.74
  Bottom 0.203: v31.76,82.81 32.05,82.81 33.21,83.97 36.3,83.97 v36.35,84.01 | v45.84,83.53 48.36,83.53 v48.57,83.74
USB+  (via drill 0.3)
  Top 0.203: R72.1 26.9,49.21 27.05,49.37 31.18,49.37 31.34,49.21 31.34,48.11 X2.3 | v34.08,48.1 34.08,50.2 35.23,51.36 v35.23,52.37 | R9.1 32.45,77.15 30.97,75.67 30.97,60.96 31.18,60.75 v32.54,60.75 | v37.43,55.31 37.23,55.51 37.23,55.54 36.48,56.3 36.48,57.76 34.87,59.37 34.87,60.08 34.85,60.1 v34.85,60.39
  Bottom 0.203: X2.3 31.33,48.1 v34.08,48.1 | v35.23,52.37 37.43,54.57 v37.43,55.31 | v34.85,60.39 34.56,60.39 34.54,60.41 32.88,60.41 v32.54,60.75
USB-  (via drill 0.3)
  Top 0.203: v34.08,51.28 34.35,51.55 v34.35,52.72 | R4.1 31.02,77.31 30.61,76.9 30.61,60.17 30.79,59.98 v32.41,59.98 | v36.67,55.31 36.12,55.86 36.12,57.61 35.31,58.42 34.42,58.42 34.1,58.74 34.1,59.65 v34.31,59.85
  Bottom 0.203: X2.2 34.07,51.29 v34.08,51.28 | v34.35,52.72 35.62,53.99 36.06,53.99 36.67,54.6 v36.67,55.31 | v34.31,59.85 32.54,59.85 v32.41,59.98